# EAGLE schematic Ring v1_0 (EAGLE 9.6.2)
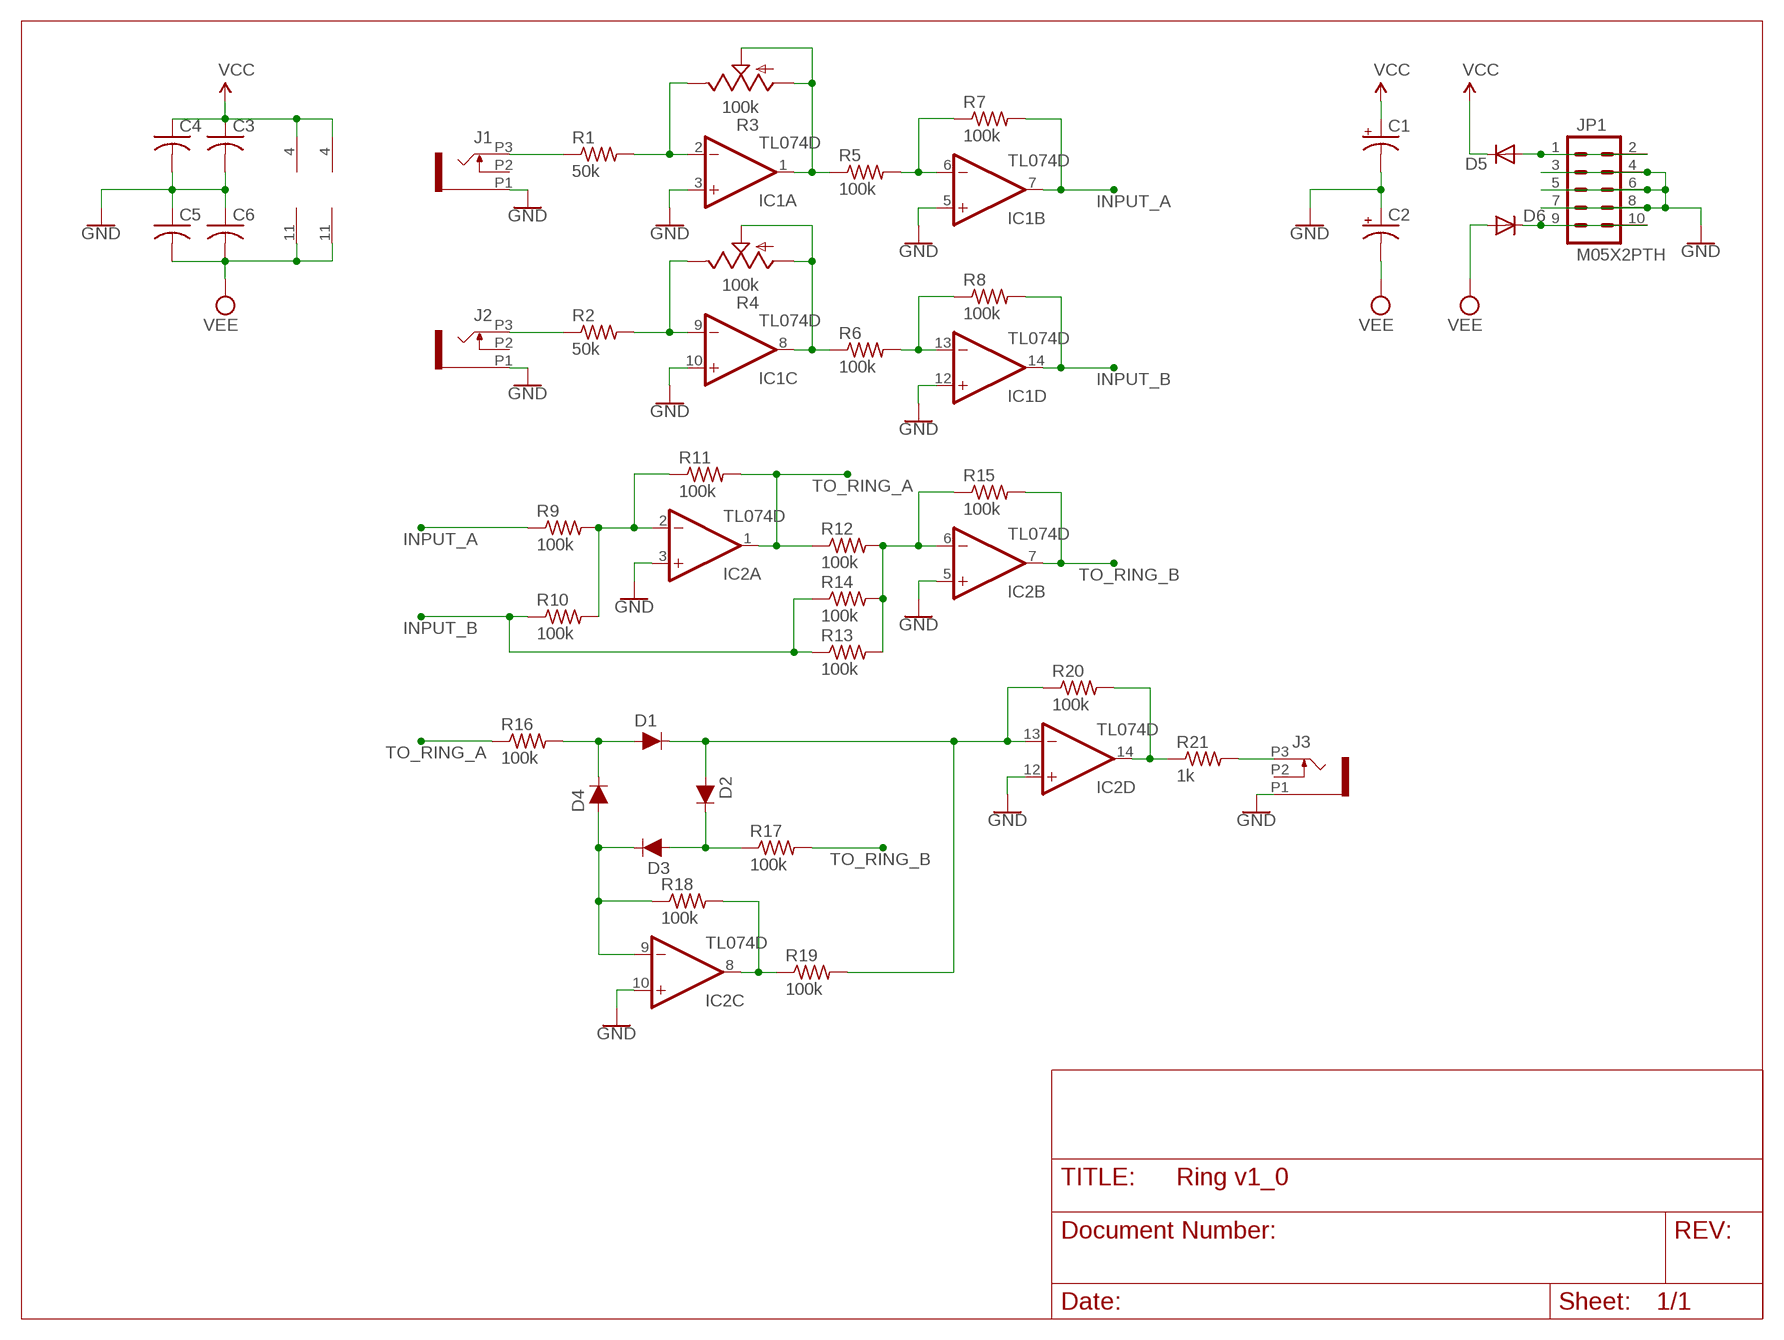
[diagram p0: schematic, sheet 1]

## Parts
C1  RCL_CPOL-USB  [RCL_PANASONIC_B]
C2  RCL_CPOL-USB  [RCL_PANASONIC_B]
C3  RCL_C-USC0603  [RCL_C0603]
C4  RCL_C-USC0603  [RCL_C0603]
C5  RCL_C-USC0603  [RCL_C0603]
C6  RCL_C-USC0603  [RCL_C0603]
D1  DIODE-PTH  [DIODE-1N4001]
D2  DIODE-PTH  [DIODE-1N4001]
D3  DIODE-PTH  [DIODE-1N4001]
D4  DIODE-PTH  [DIODE-1N4001]
D5  DIODE_DIODE-SOD123  [DIODE_SOD123]
D6  DIODE_DIODE-SOD123  [DIODE_SOD123]
IC1  TL074D  [SO14]
IC2  TL074D  [SO14]
J1  OG-PJ301_PJ301_THONKICONN8  [OG-PJ301_WQP_PJ_301M8]
J2  OG-PJ301_PJ301_THONKICONN8  [OG-PJ301_WQP_PJ_301M8]
J3  OG-PJ301_PJ301_THONKICONN8  [OG-PJ301_WQP_PJ_301M8]
JP1  M05X2PTH  OG-HEADER_M05X2PTH  [OG-HEADER_AVR_ICSP]
R1  50k  RESISTOR_R-US_R0603  [RESISTOR_R0603]
R2  50k  RESISTOR_R-US_R0603  [RESISTOR_R0603]
R3  100k  POT-ALPS_POT_USVERTICAL_PS2  [POT-ALPS_ALPS_POT_VERTICAL_PS2]
R4  100k  POT-ALPS_POT_USVERTICAL_PS2  [POT-ALPS_ALPS_POT_VERTICAL_PS2]
R5  100k  RESISTOR_R-US_R0603  [RESISTOR_R0603]
R6  100k  RESISTOR_R-US_R0603  [RESISTOR_R0603]
R7  100k  RESISTOR_R-US_R0603  [RESISTOR_R0603]
R8  100k  RESISTOR_R-US_R0603  [RESISTOR_R0603]
R9  100k  RESISTOR_R-US_R0603  [RESISTOR_R0603]
R10  100k  RESISTOR_R-US_R0603  [RESISTOR_R0603]
R11  100k  RESISTOR_R-US_R0603  [RESISTOR_R0603]
R12  100k  RESISTOR_R-US_R0603  [RESISTOR_R0603]
R13  100k  RESISTOR_R-US_R0603  [RESISTOR_R0603]
R14  100k  RESISTOR_R-US_R0603  [RESISTOR_R0603]
R15  100k  RESISTOR_R-US_R0603  [RESISTOR_R0603]
R16  100k  RESISTOR_R-US_R0603  [RESISTOR_R0603]
R17  100k  RESISTOR_R-US_R0603  [RESISTOR_R0603]
R18  100k  RESISTOR_R-US_R0603  [RESISTOR_R0603]
R19  100k  RESISTOR_R-US_R0603  [RESISTOR_R0603]
R20  100k  RESISTOR_R-US_R0603  [RESISTOR_R0603]
R21  1k  RESISTOR_R-US_R0603  [RESISTOR_R0603]

## Nets
GND: C1.- C2.+ C3.2 C4.2 C5.1 C6.1 IC1.3(A:+IN) IC1.5(B:+IN) IC1.10(C:+IN) IC1.12(D:+IN) IC2.3(A:+IN) IC2.5(B:+IN) IC2.10(C:+IN) IC2.12(D:+IN) J1.P1 J2.P1 J3.P1 JP1.3 JP1.4 JP1.5 JP1.6 JP1.7 JP1.8
INPUT_A: IC1.7(B:OUT) R7.2 R9.1
INPUT_B: IC1.14(D:OUT) R8.2 R10.1 R13.1 R14.1
N$1: J1.P3 R1.1
N$2: J2.P3 R2.1
N$3: IC1.9(C:-IN) R2.2 R4.P$1(E)
N$4: IC1.2(A:-IN) R1.2 R3.P$1(E)
N$5: IC1.1(A:OUT) R3.P$2(S) R3.P$3(A) R5.1
N$6: IC1.8(C:OUT) R4.P$2(S) R4.P$3(A) R6.1
N$7: IC2.2(A:-IN) R9.2 R10.2 R11.1
N$8: IC1.6(B:-IN) R5.2 R7.1
N$9: IC1.13(D:-IN) R6.2 R8.1
N$10: D1.A D4.C R16.2
N$11: IC2.6(B:-IN) R12.2 R13.2 R14.2 R15.1
N$12: D1.C D2.A IC2.13(D:-IN) R19.2 R20.1
N$13: D2.C D3.A R17.1
N$14: D3.C D4.A IC2.9(C:-IN) R18.1
N$15: IC2.8(C:OUT) R18.2 R19.1
N$16: IC2.14(D:OUT) R20.2 R21.1
N$17: J3.P3 R21.2
N$18: D5.A JP1.1 JP1.2
N$22: D6.C JP1.9 JP1.10
TO_RING_A: IC2.1(A:OUT) R11.2 R12.1 R16.1
TO_RING_B: IC2.7(B:OUT) R15.2 R17.2
VCC: C1.+ C3.1 C4.1 D5.C IC1.4(P:V+) IC2.4(P:V+)
VEE: C2.- C5.2 C6.2 D6.A IC1.11(P:V-) IC2.11(P:V-)
Unconnected: J1.P2 J2.P2 J3.P2

## Library data of the parts
C1 C2 = my-library:RCL_CPOL-US: POLARIZED CAPACITOR, American symbol
C3-C6 = my-library:RCL_C-US: CAPACITOR, American symbol
D1-D4 = my-library:DIODE: Diode These are standard reverse protection diodes and small signal diodes. SparkFun Products: SparkFun SparkPunk Sound Kit <https://www.sparkfun.com/products/11177> SparkFun ESP8266 Thing <https://www.sparkfun.com/products/13231>; PROD_ID: DIO-09176; VALUE: 1A/50V/1.1V
D5 D6 = my-library:DIODE_DIODE-: DIODE
IC1 IC2 = my-library:TL074: OP AMP
J1-J3 = my-library:OG-PJ301_PJ301_THONKICONN
JP1 = my-library:OG-HEADER_M05X2: Header 5x2 Standard 10-pin dual row 0.1" header. Commonly used with AVR-ISP. Use with Spark Fun Electronics SKU: PRT-00778
R1 R2 R5-R21 = my-library:RESISTOR_R-US_: RESISTOR, American symbol
R3 R4 = my-library:POT-ALPS_POT_US